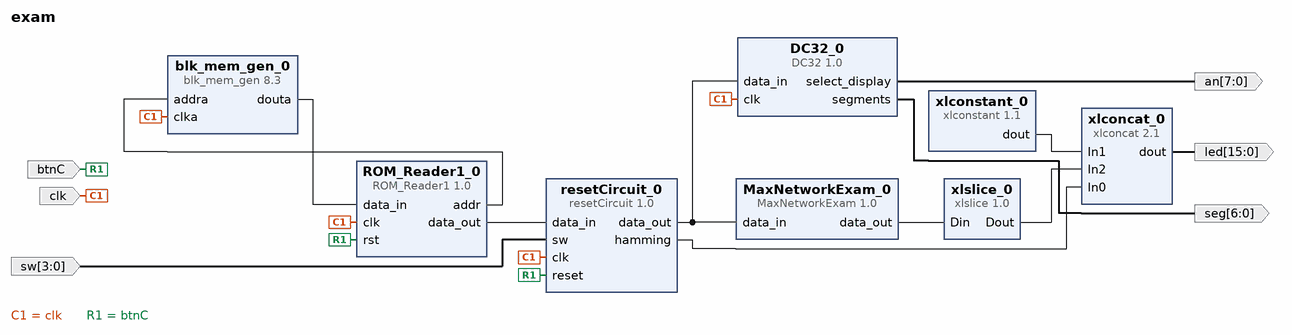
[diagram p0: block diagram of the top level]
# Vivado block design exam, Vivado 2015.4
create_bd_design exam

create_bd_port -dir I clk
create_bd_port -dir I btnC
create_bd_port -dir O -from 7 -to 0 an
create_bd_port -dir O -from 6 -to 0 seg
create_bd_port -dir I -from 3 -to 0 sw
create_bd_port -dir O -from 15 -to 0 led

create_bd_cell -type ip -vlnv xilinx.com:ip:blk_mem_gen:8.3 blk_mem_gen_0
set_property -dict [list \
  CONFIG.Memory_Type Single_Port_ROM \
  CONFIG.Enable_32bit_Address false \
  CONFIG.Write_Width_A 4 \
  CONFIG.Write_Depth_A 8 \
  CONFIG.Enable_A Always_Enabled \
  CONFIG.Register_PortA_Output_of_Memory_Primitives false \
  CONFIG.Load_Init_File true \
  CONFIG.Coe_File ../../../../../../../exam.coe \
  CONFIG.Use_RSTA_Pin false \
  CONFIG.Port_A_Write_Rate 0 \
  CONFIG.use_bram_block Stand_Alone \
] [get_bd_cells blk_mem_gen_0]
create_bd_cell -type ip -vlnv user.org:user:ROM_Reader1:1.0 ROM_Reader1_0
set_property -dict {CONFIG.data_width 4 CONFIG.address_bits 3} [get_bd_cells ROM_Reader1_0]
create_bd_cell -type ip -vlnv ua.pt:user:DC32:1.0 DC32_0
create_bd_cell -type ip -vlnv xilinx.com:ip:xlslice:1.0 xlslice_0
set_property -dict {CONFIG.DOUT_WIDTH 4 CONFIG.DIN_TO 28 CONFIG.DIN_FROM 31} [get_bd_cells xlslice_0]
create_bd_cell -type ip -vlnv user.org:user:MaxNetworkExam:1.0 MaxNetworkExam_0
create_bd_cell -type ip -vlnv xilinx.com:ip:xlconcat:2.1 xlconcat_0
set_property -dict {CONFIG.NUM_PORTS 3 CONFIG.IN0_WIDTH 3 CONFIG.IN1_WIDTH 9 CONFIG.IN2_WIDTH 4} [get_bd_cells xlconcat_0]
create_bd_cell -type ip -vlnv xilinx.com:ip:xlconstant:1.1 xlconstant_0
set_property -dict {CONFIG.CONST_WIDTH 9 CONFIG.CONST_VAL 0} [get_bd_cells xlconstant_0]
create_bd_cell -type ip -vlnv user.org:user:resetCircuit:1.0 resetCircuit_0

# ---- connections ----

connect_bd_net [get_bd_ports clk] \
  [get_bd_pins blk_mem_gen_0/clka] [get_bd_pins ROM_Reader1_0/clk] [get_bd_pins DC32_0/clk] [get_bd_pins resetCircuit_0/clk]
connect_bd_net [get_bd_ports btnC] [get_bd_pins ROM_Reader1_0/rst] [get_bd_pins resetCircuit_0/reset]
connect_bd_net [get_bd_pins blk_mem_gen_0/douta] [get_bd_pins ROM_Reader1_0/data_in]
connect_bd_net [get_bd_pins ROM_Reader1_0/addr] [get_bd_pins blk_mem_gen_0/addra]
connect_bd_net [get_bd_pins DC32_0/select_display] [get_bd_ports an]
connect_bd_net [get_bd_pins DC32_0/segments] [get_bd_ports seg]
connect_bd_net [get_bd_pins MaxNetworkExam_0/data_out] [get_bd_pins xlslice_0/Din]
connect_bd_net [get_bd_ports sw] [get_bd_pins resetCircuit_0/sw]
connect_bd_net [get_bd_pins ROM_Reader1_0/data_out] [get_bd_pins resetCircuit_0/data_in]
connect_bd_net [get_bd_pins resetCircuit_0/data_out] [get_bd_pins MaxNetworkExam_0/data_in] [get_bd_pins DC32_0/data_in]
connect_bd_net [get_bd_pins xlconcat_0/dout] [get_bd_ports led]
connect_bd_net [get_bd_pins xlslice_0/Dout] [get_bd_pins xlconcat_0/In2]
connect_bd_net [get_bd_pins xlconstant_0/dout] [get_bd_pins xlconcat_0/In1]
connect_bd_net [get_bd_pins resetCircuit_0/hamming] [get_bd_pins xlconcat_0/In0]

validate_bd_design
save_bd_design
